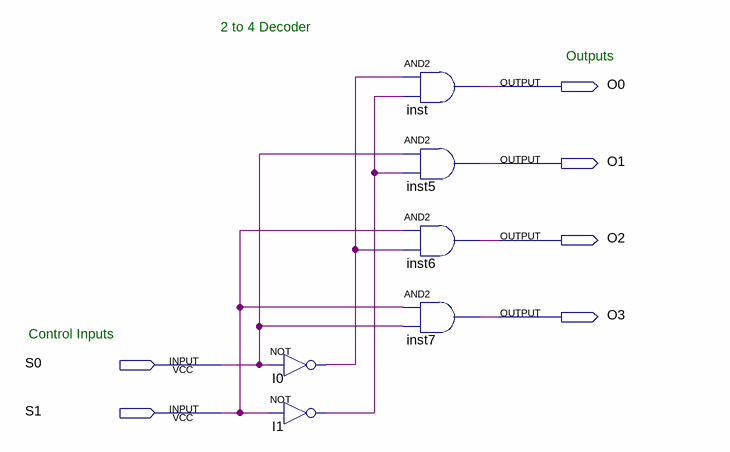
[diagram p0: schematic sheet]
// Quartus schematic 2_to_4_Decoder.bdf as structural Verilog: 6 symbols, 6 pins
module \2_to_4_Decoder  (
  input  S0,
  input  S1,
  output O0,
  output O1,
  output O2,
  output O3
);

  wire I0_out, I1_out;

  not I0 (I0_out, S0);
  not I1 (I1_out, S1);
  and inst (O0, I0_out, I1_out);
  and inst5 (O1, S0, I1_out);
  and inst6 (O2, S1, I0_out);
  and inst7 (O3, S1, S0);

  // Notes on the sheet:
  //   2 to 4 Decoder
  //   Outputs
  //   Control Inputs
endmodule
